# EAGLE design onspeed (EAGLE 8.6.0)
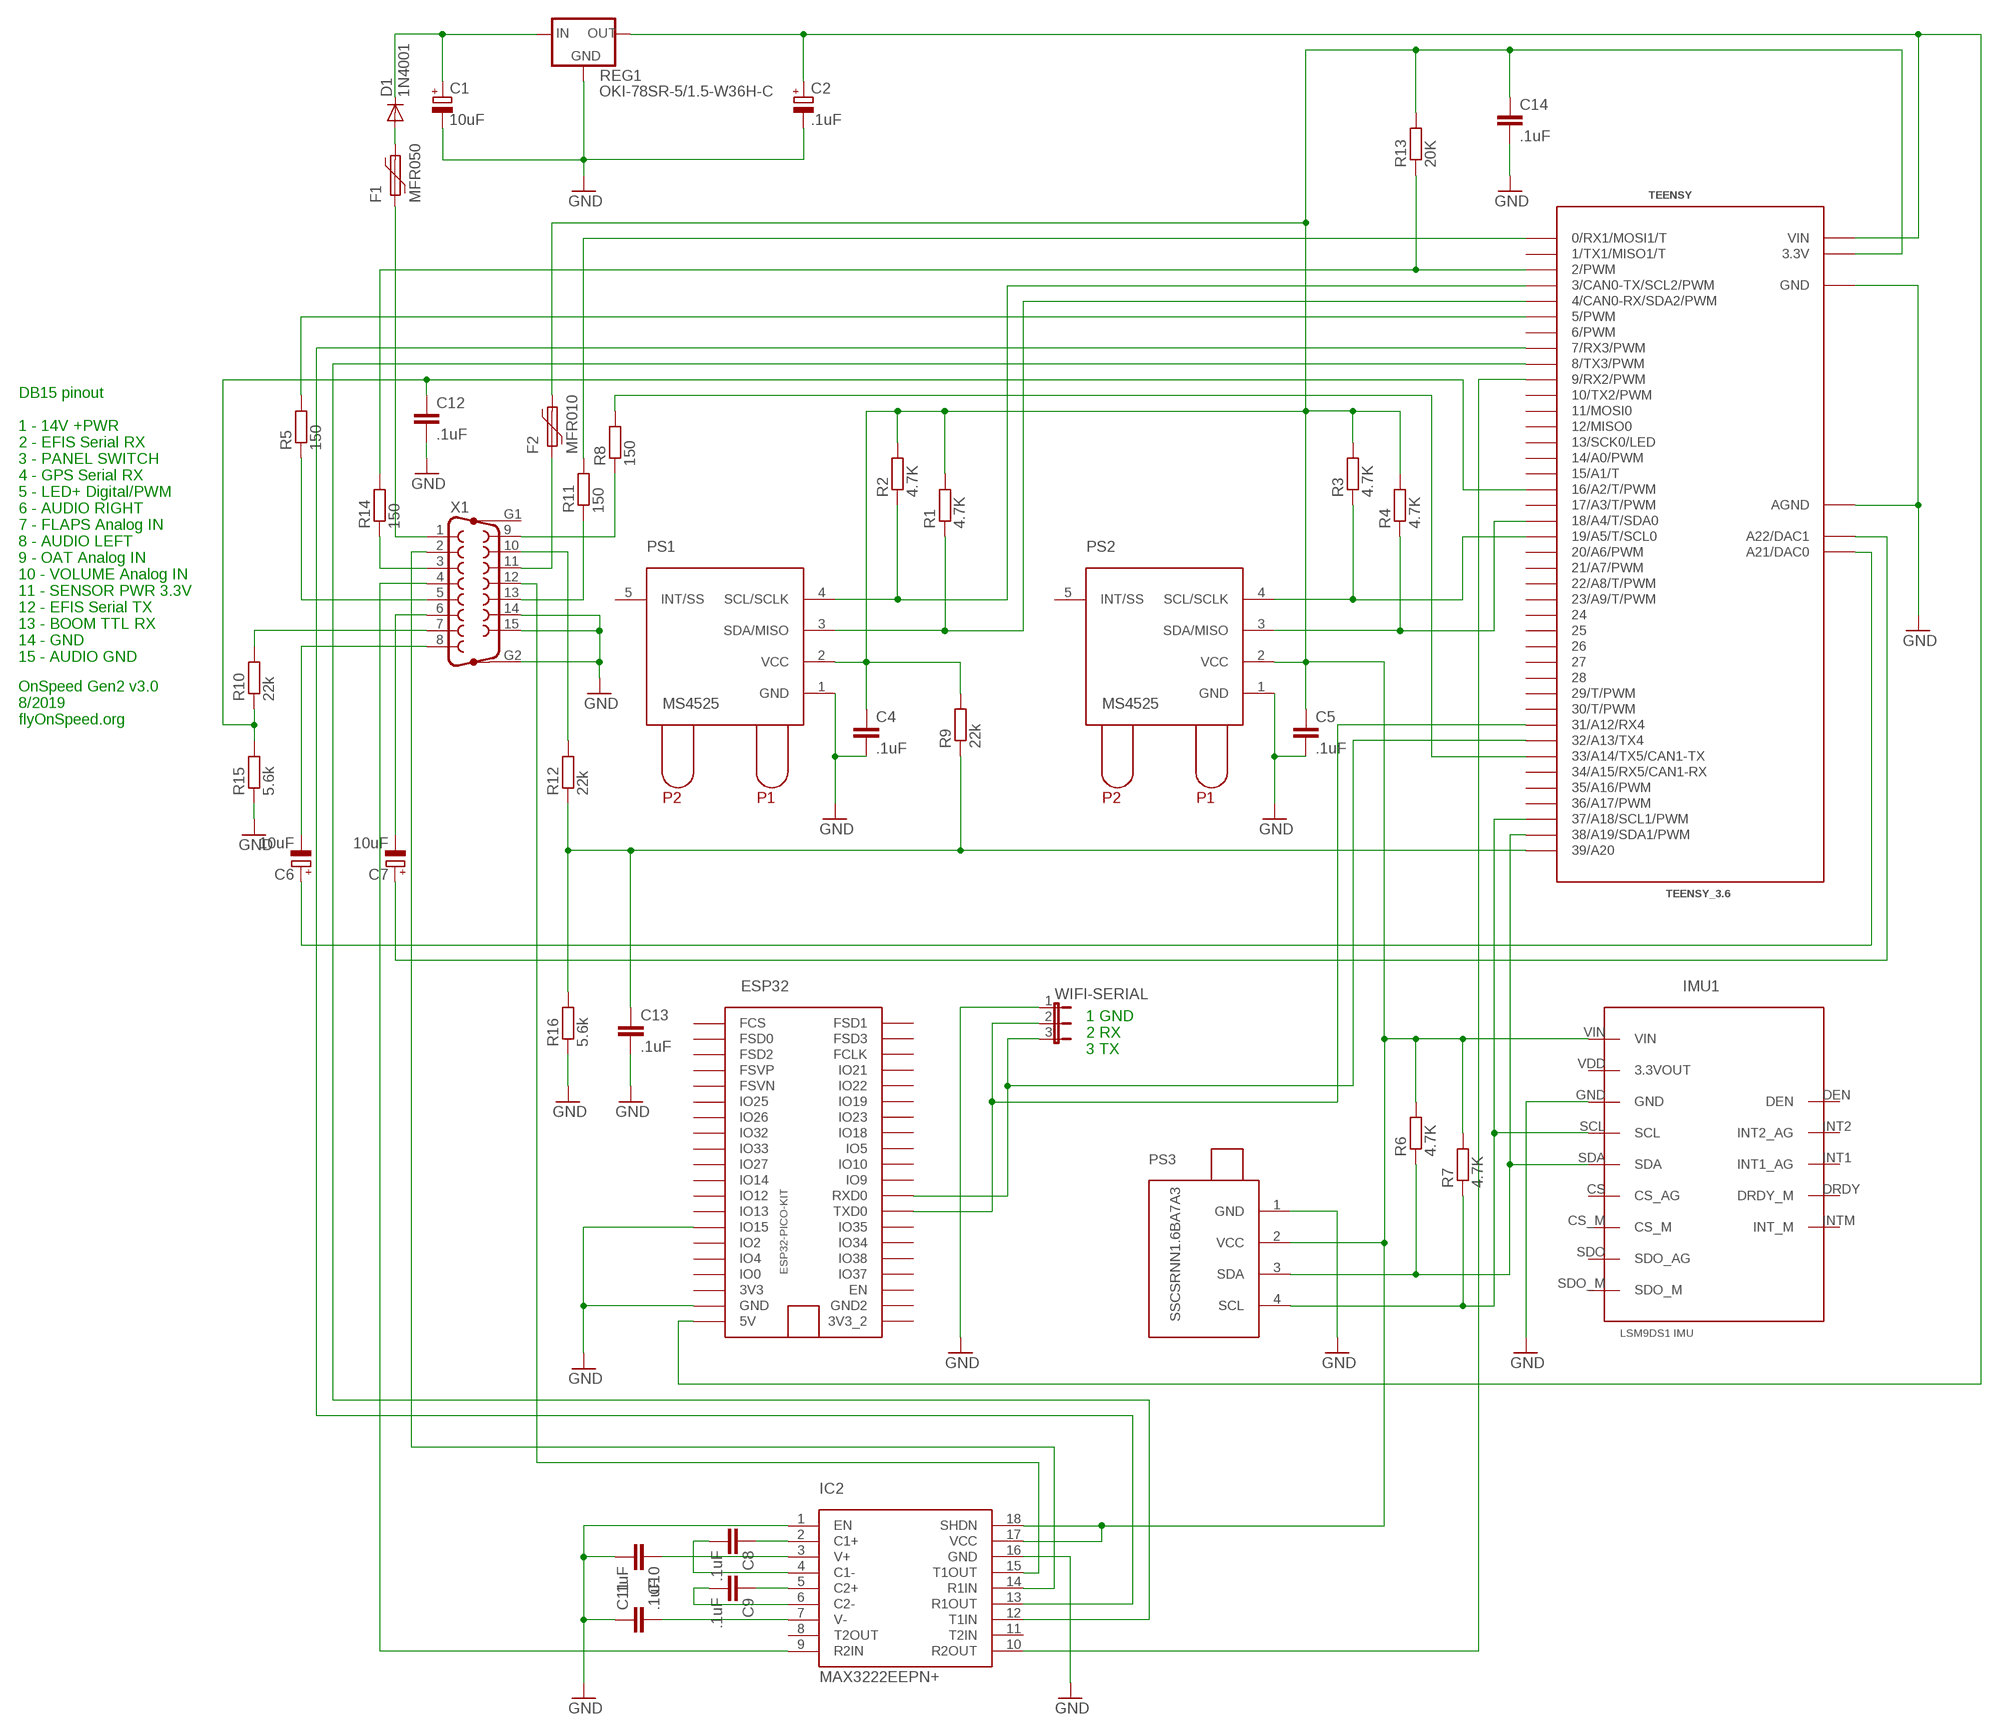
[diagram p0: schematic, sheet 1]

## Parts
C1  10uF  CPOL-EUE2-5  [E2-5]
C2  .1uF  CPOL-EUE2-5  [E2-5]
C4  .1uF  C-EU025-025X050  [C025-025X050]
C5  .1uF  C-EU025-025X050  [C025-025X050]
C6  10uF  CPOL-EUE2-5  [E2-5]
C7  10uF  CPOL-EUE2-5  [E2-5]
C8  .1uF  C-EU025-025X050  [C025-025X050]
C9  .1uF  C-EU025-025X050  [C025-025X050]
C10  .1uF  C-EU025-025X050  [C025-025X050]
C11  .1uF  C-EU025-025X050  [C025-025X050]
C12  .1uF  C-EU025-025X050  [C025-025X050]
C13  .1uF  C-EU025-025X050  [C025-025X050]
C14  .1uF  C-EU025-025X050  [C025-025X050]
D1  1N4001  [DO41-10]
ESP32  ESP32-PICO-KIT  ESP32-PICO-KITPICO  [ESP32PICOKIT]
F1  MFR050  MF-R055-5,1B  [MF-5,1B]
F2  MFR010  MF-R055-5,1B  [MF-5,1B]
IC2  MAX3222EEPN+  [DIL18]
IMU1  LSM9DS1 IMU  LSM9DS1_BREAKOUT  [LSM9DS1_BREAKOUT]
PS1  MS4525  [DIL08-500]
PS2  MS4525  [DIL08-500]
PS3  SSCSRNN1.6BA7A3  [SIP-RN]
R1  4.7K  R-EU_0207/10  [0207/10]
R2  4.7K  R-EU_0207/10  [0207/10]
R3  4.7K  R-EU_0207/10  [0207/10]
R4  4.7K  R-EU_0207/10  [0207/10]
R5  150  R-EU_0207/10  [0207/10]
R6  4.7K  R-EU_0207/10  [0207/10]
R7  4.7K  R-EU_0207/10  [0207/10]
R8  150  R-EU_0207/10  [0207/10]
R9  22k  R-EU_0207/10  [0207/10]
R10  22k  R-EU_0207/10  [0207/10]
R11  150  R-EU_0207/10  [0207/10]
R12  22k  R-EU_0207/10  [0207/10]
R13  20K  R-EU_0207/10  [0207/10]
R14  150  R-EU_0207/10  [0207/10]
R15  5.6k  R-EU_0207/10  [0207/10]
R16  5.6k  R-EU_0207/10  [0207/10]
REG1  OKI-78SR-5/1.5-W36H-C  [SIP3H]
TEENSY  TEENSY_3.6  TEENSY_3.6_DIL  [TEENSY_3.6_DIL]
WIFI-SERIAL  JP2E  [JP2]
X1  F15HP  [F15HP]

## Nets
GND [power]: C1.- C2.- C4.2 C5.2 C10.2 C11.1 C12.2 C13.2 C14.2 ESP32.P$GND(GND) ESP32.P$IO15(IO15) IC2.1(EN) IC2.16(GND) IMU1.GND PS1.1(GND) PS2.1(GND) PS3.1(GND) R15.1 R16.1 REG1.2(GND) TEENSY.AGND TEENSY.GND TEENSY.GND1(GND) WIFI-SERIAL.1 X1.14 X1.15 X1.G2
N$1 [power]: C1.+ D1.C REG1.1(IN)
N$2: IC2.15(T1OUT) X1.12
N$3: R12.2 X1.10
N$4: C2.+ ESP32.P$5V(5V) REG1.3(OUT) TEENSY.VIN
N$5: C12.1 R10.1 R15.2 TEENSY.16/A2(16/A2/T/PWM)
N$6: C7.- X1.6
N$7: R5.2 TEENSY.5(5/PWM)
N$8: IC2.12(T1IN) TEENSY.8(8/TX3/PWM)
N$9: ESP32.P$RXD0(RXD0) TEENSY.32/A13(32/A13/TX4) WIFI-SERIAL.3
N$10: ESP32.P$TXD0(TXD0) TEENSY.31/A12(31/A12/RX4) WIFI-SERIAL.2
N$11: IC2.9(R2IN) X1.4
N$12: R11.2 TEENSY.0(0/RX1/MOSI1/T)
N$13: IC2.14(R1IN) X1.2
N$14: IC2.10(R2OUT) TEENSY.9(9/RX2/PWM)
N$15: C7.+ TEENSY.A22(A22/DAC1)
N$16: PS1.4(SCL/SCLK) R2.1 TEENSY.3(3/CAN0-TX/SCL2/PWM)
N$17: PS1.3(SDA/MISO) R1.1 TEENSY.4(4/CAN0-RX/SDA2/PWM)
N$18: R8.2 TEENSY.33/A14(33/A14/TX5/CAN1-TX)
N$19: PS2.4(SCL/SCLK) R3.1 TEENSY.19/A5(19/A5/T/SCL0)
N$20 [power]: D1.A F1.2
N$21: PS2.3(SDA/MISO) R4.1 TEENSY.18/A4(18/A4/T/SDA0)
N$22: R13.1 R14.2 TEENSY.2(2/PWM)
N$23: C6.- X1.8
N$24: IC2.13(R1OUT) TEENSY.7(7/RX3/PWM)
N$25: R8.1 X1.9
N$26: C6.+ TEENSY.A21(A21/DAC0)
N$27: C8.2 IC2.4(C1-)
N$28: C13.1 R9.1 R12.1 R16.2 TEENSY.39/A20
N$29 [power]: F1.1 X1.1
N$30: C4.1 C5.1 C14.1 F2.2 IC2.17(VCC) IC2.18(SHDN) IMU1.VIN PS1.2(VCC) PS2.2(VCC) PS3.2(VCC) R1.2 R2.2 R3.2 R4.2 R6.2 R7.2 R9.2 R13.2 TEENSY.3.3V TEENSY.3.3V3(3.3V)
N$31: C9.2 IC2.6(C2-)
N$33: F2.1 X1.11
N$34: IMU1.SCL PS3.4(SCL) R7.1 TEENSY.37/A18(37/A18/SCL1/PWM)
N$35: IMU1.SDA PS3.3(SDA) R6.1 TEENSY.38/A19(38/A19/SDA1/PWM)
N$36: C11.2 IC2.7(V-)
N$37: R5.1 X1.5
N$38: C10.1 IC2.3(V+)
N$39: C8.1 IC2.2(C1+)
N$40: C9.1 IC2.5(C2+)
N$41: R11.1 X1.13
N$42: R10.2 X1.7
N$43: R14.1 X1.3
Unconnected: ESP32.P$3V3(3V3) ESP32.P$3V3_2(3V3_2) ESP32.P$EN(EN) ESP32.P$FCLK(FCLK) ESP32.P$FCS(FCS) ESP32.P$FSD0(FSD0) ESP32.P$FSD1(FSD1) ESP32.P$FSD2(FSD2) ESP32.P$FSD3(FSD3) ESP32.P$FSVN(FSVN) ESP32.P$FSVP(FSVP) ESP32.P$GND2(GND2) ESP32.P$IO0(IO0) ESP32.P$IO2(IO2) ESP32.P$IO4(IO4) ESP32.P$IO5(IO5) ESP32.P$IO9(IO9) ESP32.P$IO10(IO10) ESP32.P$IO12(IO12) ESP32.P$IO13(IO13) ESP32.P$IO14(IO14) ESP32.P$IO18(IO18) ESP32.P$IO19(IO19) ESP32.P$IO21(IO21) ESP32.P$IO22(IO22) ESP32.P$IO23(IO23) ESP32.P$IO25(IO25) ESP32.P$IO26(IO26) ESP32.P$IO27(IO27) ESP32.P$IO32(IO32) ESP32.P$IO33(IO33) ESP32.P$IO34(IO34) ESP32.P$IO35(IO35) ESP32.P$IO37(IO37) ESP32.P$IO38(IO38) IC2.8(T2OUT) IC2.11(T2IN) IMU1.CS(CS_AG) IMU1.CS_M IMU1.DEN IMU1.DRDY(DRDY_M) IMU1.INT1(INT1_AG) IMU1.INT2(INT2_AG) IMU1.INTM(INT_M) IMU1.SDO(SDO_AG) IMU1.SDO_M IMU1.VDD(3.3VOUT) PS1.5(INT/SS) PS2.5(INT/SS) TEENSY.1(1/TX1/MISO1/T) TEENSY.6(6/PWM) TEENSY.10(10/TX2/PWM) TEENSY.11(11/MOSI0) TEENSY.12(12/MISO0) TEENSY.13(13/SCK0/LED) TEENSY.14/A0(14/A0/PWM) TEENSY.15/A1(15/A1/T) TEENSY.17/A3(17/A3/T/PWM) TEENSY.20/A6(20/A6/PWM) TEENSY.21/A7(21/A7/PWM) TEENSY.22/A8(22/A8/T/PWM) TEENSY.23/A9(23/A9/T/PWM) TEENSY.24 TEENSY.25 TEENSY.26 TEENSY.27 TEENSY.28 TEENSY.29(29/T/PWM) TEENSY.30(30/T/PWM) TEENSY.34/A15(34/A15/RX5/CAN1-RX) TEENSY.35/A16(35/A16/PWM) TEENSY.36/A17(36/A17/PWM) X1.G1

## Notes on the sheet
- DB15 pinout
  
  1 - 14V +PWR
  2 - EFIS Serial RX
  3 - PANEL SWITCH
  4 - GPS Serial RX
  5 - LED+ Digital/PWM
  6 - AUDIO RIGHT
  7 - FLAPS Analog IN
  8 - AUDIO LEFT
  9 - OAT Analog IN
  10 - VOLUME Analog IN
  11 - SENSOR PWR 3.3V
  12 - EFIS Serial TX
  13 - BOOM TTL RX
  14 - GND
  15 - AUDIO GND
- OnSpeed Gen2 v3.0
  8/2019
  flyOnSpeed.org
- 1 GND
  2 RX
  3 TX

## Library data of the parts
C1 C2 C6 C7 = resistor:CPOL-EU: POLARIZED CAPACITOR, European symbol
C4 C5 C12-C14 = rcl:C-EU: CAPACITOR, European symbol
C8-C11 = rcl:C-EU: CAPACITOR, European symbol; SPICEPREFIX: C
D1 = diode:1N4001: DIODE general purpose rectifier, 1 A
ESP32 = ESP32PicoKit:ESP32-PICO-KIT
F1 F2 = bourns2:MF-R055: MultiFuse Polyfuse Overcurrent Protectors
IC2 = MAX3222E:MAX3222E
IMU1 = adafruit_LSM9DS1:LSM9DS1_BREAKOUT
PS1 PS2 = MS4525:MS4525
PS3 = honeywell_SSC_sensor:SSCSRNN1.6BA7A3
R1-R16 = rcl:R-EU_: RESISTOR, European symbol
REG1 = Murata_OKI-78SR:OKI-78SR-5
TEENSY = Teensy_3_and_LC_Series_Boards_v1.4:TEENSY_3.6_DIL: Teensy 3.6 DIL Package
WIFI-SERIAL = jumper:JP2E: JUMPER
X1 = F15HP-HARTING:F15HP: SUB-D; OC_FARNELL: unknown; OC_NEWARK: unknown

## Net classes
0 default: width 0.508 mm, clearance 0.203 mm
1 power: width 0.635 mm, clearance 0.203 mm to class 0, clearance 0.203 mm

## Board
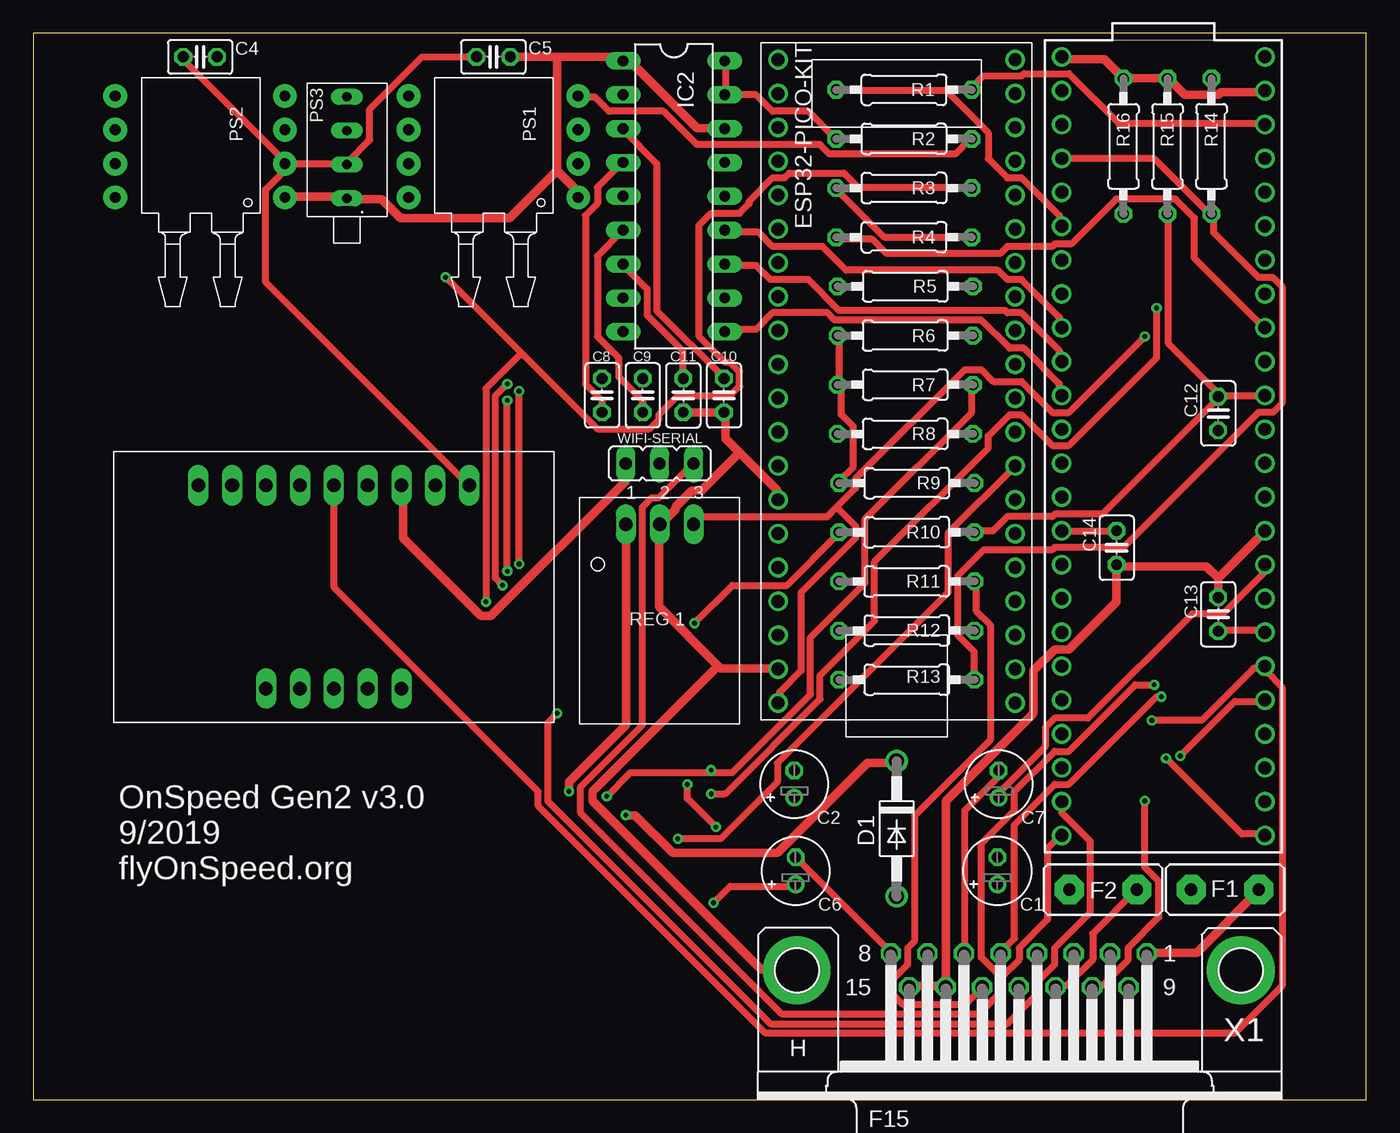
[diagram p1: board, top side]
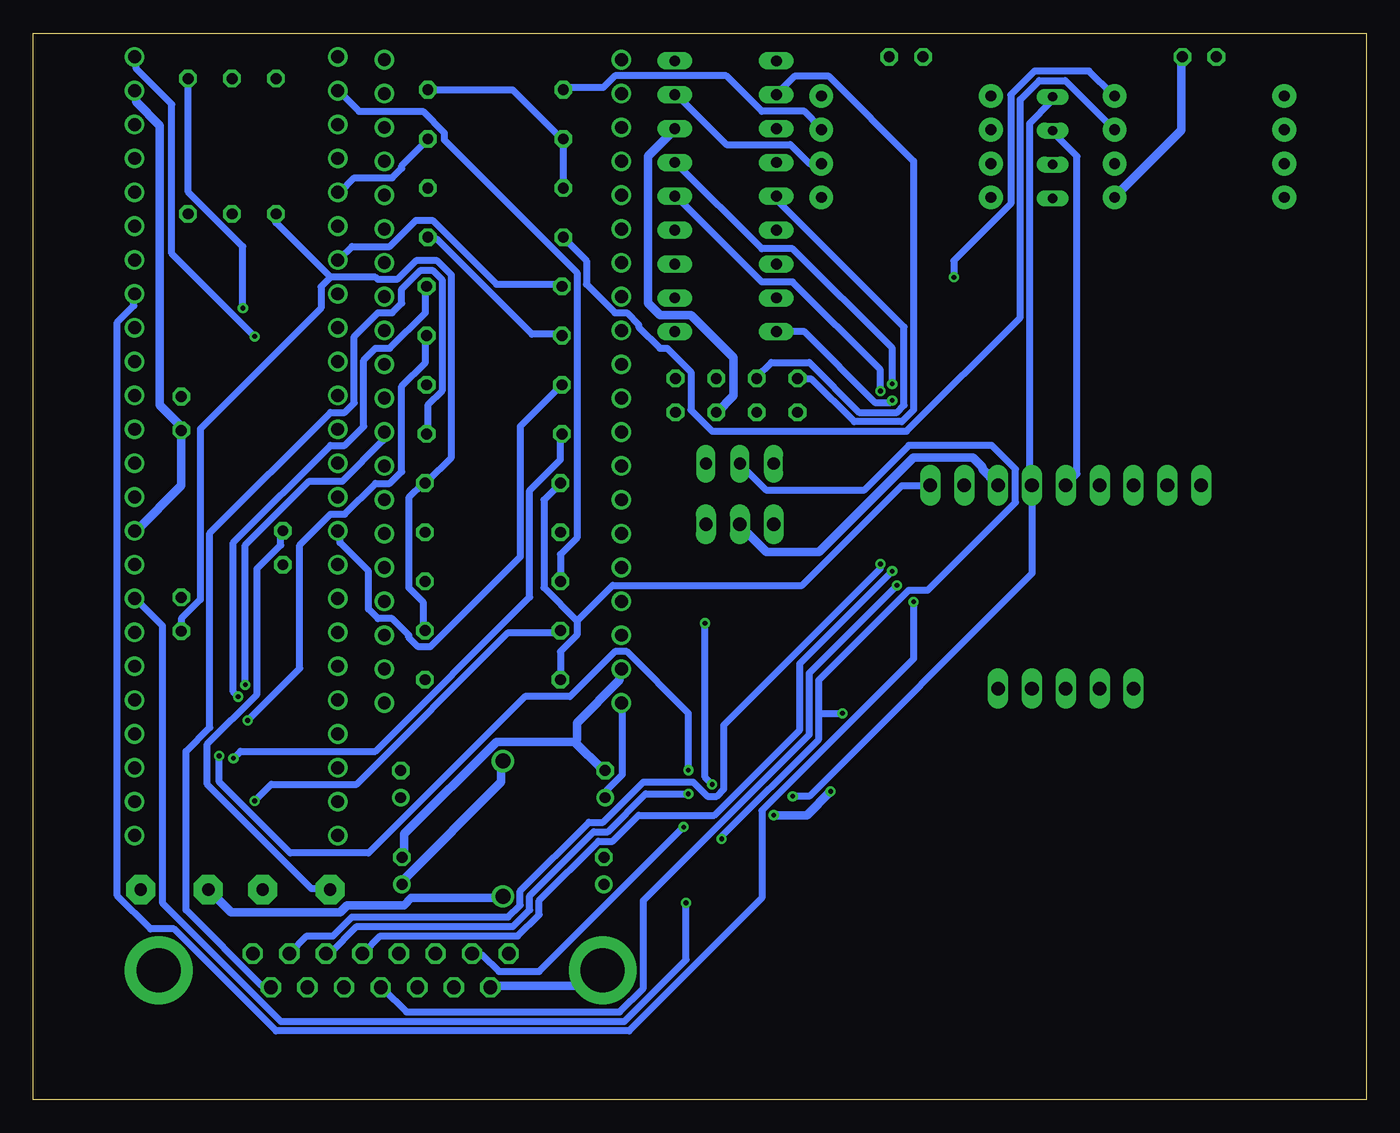
[diagram p2: board, bottom side, seen from below]

Size 100 x 80 mm. Coordinates in mm from the lower left corner, seen from the top.
Outline: 0,0 100,0 100,80 0,80 0,0
Copper layers (1*16): Top 0.035mm / dielectric 1.5mm / Bottom 0.035mm
Design rules "default *": minimum track width 10mil, minimum drill 0.35mm, track to track 6mil, track to pad 6mil, pad to pad 6mil, via to via 6mil, smd to smd 6mil, copper to edge 40mil, drill to drill 6mil, minimum pad ring 10mil, minimum via ring 8mil, stop-mask expansion 2mil, vias tented up to drill 0mil, thermal gap 10mil
tRestrict: area 0,0 to 4.5,80; area 95.5,0 to 100,80
bRestrict: area 0,0 to 4.5,80; area 95.5,0 to 100,80
vRestrict: area 55,0 to 95,6

### Footprints (pad centres in the part's own frame; a part is rotated, then mirrored left to right if it is on the bottom)
E2-5 = drill 0.813 pad 1.27: + -1.016,0 | drill 0.813 pad 1.27 octagon: - 1.016,0
C025-025X050 = drill 0.813 octagon: 1 -1.27,0; 2 1.27,0
DO41-10 = drill 1.118: A 5.08,0; C -5.08,0
ESP32PICOKIT = drill 0.965: P$3V3 -7.62,-10.16; P$3V3_2 10.16,-15.24; P$5V -7.62,-15.24; P$EN 10.16,-10.16; P$FCLK 10.16,27.94; P$FCS -7.62,33.02; P$FSD0 -7.62,30.48; P$FSD1 10.16,33.02; P$FSD2 -7.62,27.94; P$FSD3 10.16,30.48; P$FSVN -7.62,22.86; P$FSVP -7.62,25.4; P$GND -7.62,-12.7; P$GND2 10.16,-12.7; P$IO0 -7.62,-7.62; P$IO2 -7.62,-2.54; P$IO4 -7.62,-5.08; P$IO5 10.16,12.7; P$IO9 10.16,7.62; P$IO10 10.16,10.16; P$IO12 -7.62,5.08; P$IO13 -7.62,2.54; P$IO14 -7.62,7.62; P$IO15 -7.62,0; P$IO18 10.16,15.24; P$IO19 10.16,20.32; P$IO21 10.16,25.4; P$IO22 10.16,22.86; P$IO23 10.16,17.78; P$IO25 -7.62,20.32; P$IO26 -7.62,17.78; P$IO27 -7.62,10.16; P$IO32 -7.62,15.24; P$IO33 -7.62,12.7; P$IO34 10.16,-2.54; P$IO35 10.16,0; P$IO37 10.16,-7.62; P$IO38 10.16,-5.08; P$RXD0 10.16,5.08; P$TXD0 10.16,2.54
MF-5,1B = drill 0.914 pad 2.184 octagon: 1 -2.54,0; 2 2.54,0
DIL18 = drill 0.813 long: 1 -10.16,-3.81; 2 -7.62,-3.81; 3 -5.08,-3.81; 4 -2.54,-3.81; 5 0,-3.81; 6 2.54,-3.81; 7 5.08,-3.81; 8 7.62,-3.81; 9 10.16,-3.81; 10 10.16,3.81; 11 7.62,3.81; 12 5.08,3.81; 13 2.54,3.81; 14 0,3.81; 15 -2.54,3.81; 16 -5.08,3.81; 17 -7.62,3.81; 18 -10.16,3.81
LSM9DS1_BREAKOUT = drill 1.016 long: CS 0,-5.08; CS_M 2.54,-5.08; DEN -7.62,10.16; DRDY 0,10.16; GND -7.62,-5.08; INT1 -2.54,10.16; INT2 -5.08,10.16; INTM 2.54,10.16; SCL -5.08,-5.08; SDA -2.54,-5.08; SDO 5.08,-5.08; SDO_M 7.62,-5.08; VDD -10.16,-5.08; VIN -12.7,-5.08
DIL08-500 = drill 0.813 pad 1.778: 1 -3.81,-6.38; 2 -1.27,-6.38; 3 1.27,-6.38; 4 3.81,-6.38; 5 3.81,6.35; 6 1.27,6.35; 7 -1.27,6.35; 8 -3.81,6.35
SIP-RN = drill 0.7 long: 1 -7.62,0; 2 -5.08,0; 3 -2.54,0; 4 0,0
0207/10 = drill 0.813 octagon: 1 -5.08,0; 2 5.08,0
SIP3H = drill 1 long: 1 2.54,0; 2 0,0; 3 -2.54,0
TEENSY_3.6_DIL = drill 0.965: 0 -7.62,25.4; 1 -7.62,22.86; 2 -7.62,20.32; 3 -7.62,17.78; 3.3V 7.62,22.86; 3.3V3 -7.62,-7.62; 4 -7.62,15.24; 5 -7.62,12.7; 6 -7.62,10.16; 7 -7.62,7.62; 8 -7.62,5.08; 9 -7.62,2.54; 10 -7.62,0; 11 -7.62,-2.54; 12 -7.62,-5.08; 13 7.62,-5.08; 14/A0 7.62,-2.54; 15/A1 7.62,0; 16/A2 7.62,2.54; 17/A3 7.62,5.08; 18/A4 7.62,7.62; 19/A5 7.62,10.16; 20/A6 7.62,12.7; 21/A7 7.62,15.24; 22/A8 7.62,17.78; 23/A9 7.62,20.32; 24 -7.62,-10.16; 25 -7.62,-12.7; 26 -7.62,-15.24; 27 -7.62,-17.78; 28 -7.62,-20.32; 29 -7.62,-22.86; 30 -7.62,-25.4; 31/A12 -7.62,-27.94; 32/A13 -7.62,-30.48; 33/A14 7.62,-30.48; 34/A15 7.62,-27.94; 35/A16 7.62,-25.4; 36/A17 7.62,-22.86; 37/A18 7.62,-20.32; 38/A19 7.62,-17.78; 39/A20 7.62,-15.24; A21 7.62,-12.7; A22 7.62,-10.16; AGND 7.62,25.4; GND -7.62,27.94; GND1 7.62,-7.62; VIN 7.62,27.94
JP2 = drill 0.914 long: 1 -2.54,0; 2 0,0; 3 2.54,0
F15HP = drill 1.016 octagon: 1 -9.601,-1.27; 2 -6.858,-1.27; 3 -4.115,-1.27; 4 -1.372,-1.27; 5 1.372,-1.27; 6 4.115,-1.27; 7 6.858,-1.27; 8 9.601,-1.27; 9 -8.23,1.27; 10 -5.486,1.27; 11 -2.743,1.27; 12 0,1.27; 13 2.743,1.27; 14 5.486,1.27; 15 8.23,1.27 | drill 3.302 pad 5.08: G1 -16.662,0; G2 16.662,0

### Placement (x,y rotation side)
C1  72.34,17.16 90 top
C2  57.1,23.67 90 top
C4  12.52,78.23 0 top
C5  34.52,78.23 0 top
C6  57.19,17.16 90 top
C7  72.43,23.67 90 top
C8  42.67,52.83 270 top
C9  45.72,52.83 270 top
C10  51.82,52.83 270 top
C11  48.77,52.83 90 top
C12  88.9,51.48 270 top
C13  88.9,36.41 90 top
C14  81.28,41.4 270 top
D1  64.77,20.32 270 top
ESP32  63.5,45 0 top
F1  89.41,15.75 180 top
F2  80.26,15.75 180 top
IC2  48.06,67.77 270 top
IMU1  20,41 180 top
PS1  34.5,71.49 90 top
PS2  12.5,71.49 90 top
PS3  23.53,75.24 90 top
R1  65.32,75.77 0 top
R2  65.32,72.08 180 top
R3  65.32,68.39 180 top
R4  65.32,64.7 0 top
R5  65.42,61.01 180 top
R6  65.42,57.32 180 top
R7  65.42,53.63 180 top
R8  65.42,49.94 180 top
R9  65.53,46.25 180 top
R10  65.53,42.56 180 top
R11  65.53,38.87 180 top
R12  65.53,35.19 180 top
R13  65.53,31.5 180 top
R14  88.39,71.52 270 top
R15  85.09,71.52 270 top
R16  81.79,71.52 270 top
REG1  46.99,43.16 180 top
TEENSY  84.78,50.29 0 top
WIFI-SERIAL  46.99,47.71 0 top
X1  73.94,9.69 180 top

### Tracks (layer width: path | path; a pad name or v marks a point on that pad's centre or on a via)
GND
  Top 0.635: TEENSY.GND 77.17,78.05 80.37,78.05 81.61,76.81 R16.1 81.79,76.63 84.99,76.63 R15.1 85.34,76.45 86.41,75.39 88.9,75.39 89.08,75.56 92.28,75.56 TEENSY.AGND | 88.9,39.12 C13.2 | 88.9,39.12 92.28,42.49 TEENSY.GND1 | 88.9,39.12 88.01,40.01 81.43,40.01 C14.2 81.25,39.83 81.25,37.34 77.7,33.78 76.63,33.78 75.03,32.18 75.03,28.98 68.45,22.4 68.45,8.71 X1.14 68.45,8.53 65.79,8.53 X1.15 | PS2.1 19.02,67.74 23.47,67.74 PS3.1 23.82,67.56 26.14,67.56 27.56,66.14 35.74,66.14 39.29,69.7 | 39.29,78.23 43.92,78.23 44.09,78.05 IC2.1 44.45,77.7 44.98,77.7 49.78,72.9 51.74,72.9 IC2.16 | 39.29,78.23 C5.2 | 39.29,69.7 40.72,68.28 40.72,67.74 PS1.1 | 39.29,78.23 39.29,69.7 | WIFI-SERIAL.1 44.45,47.65 44.45,46.41 34.31,36.27 33.6,36.27 27.74,42.14 27.74,46.05 IMU1.GND | C11.1 C10.2 51.92,51.38 51.92,49.61 52.98,48.54 | 52.98,48.54 55.83,45.7 55.83,45.16 ESP32.P$IO15 | 52.98,48.54 50.14,45.7 49.43,45.7 48.18,44.45 48.18,44.27 47.12,43.2 REG1.2 46.94,42.85 46.94,36.98 51.38,32.54 | 51.38,32.54 51.56,32.36 55.83,32.36 ESP32.P$GND | 51.38,32.54 41.96,23.11 41.96,22.4 54.59,9.78 57.25,9.78 X1.G2
  Bottom 0.635: TEENSY.GND1 92.28,42.67 88.9,46.05 C12.2 88.9,50.49 90.5,52.09 90.5,73.08 92.28,74.85 92.28,75.56 TEENSY.AGND | C4.2 13.87,78.23 13.87,72.72 18.85,67.74 PS2.1 | X1.15 65.61,8.53 58.5,8.53 57.43,9.6 X1.G2 | 59.38,26.85 65.25,26.85 72.19,19.91 72.19,18.31 C1.- | 59.38,26.85 57.25,24.71 C2.- | ESP32.P$GND 56.01,32.18 56.01,31.47 59.21,28.27 59.21,27.03 59.38,26.85 | IMU1.GND 27.74,46.23 28.8,47.3 28.8,47.47 29.52,48.18 33.96,48.18 41.07,41.07 44.98,41.07 46.94,43.03 REG1.2 | IC2.16 51.92,72.72 53.87,70.76 53.87,59.74 52.98,58.85 50.67,58.85 47.47,55.65 47.47,52.81 48.72,51.56 C11.1
N$1  (via drill 0.35)
  Top 0.635: v40.18,23.11 40.18,23.82 44.45,28.09 44.45,43.03 REG1.1 | v44.45,21.34 45.16,21.34 48.01,18.49 55.83,18.49 62.59,25.25 64.72,25.25 D1.C
  Bottom 0.635: C1.+ 72.19,16.18 72.19,16.54 64.9,23.82 64.9,25.25 D1.C | v40.18,23.11 41.96,21.34 v44.45,21.34
N$2  (via drill 0.35)
  Top 0.508: v35.56,53.7 34.67,52.81 34.67,39.12 v35.2,38.58
  Bottom 0.508: v35.56,53.7 35.56,56.36 43.03,63.83 45.34,63.83 51.74,70.23 IC2.15 | v35.2,38.58 41.78,32 41.78,27.38 54.23,14.94 54.23,8.36 56.01,6.58 72.01,6.58 73.79,8.36 X1.12
N$3  (via drill 0.35)
  Top 0.508: v83.39,22.4 83.39,17.42 84.45,16.36 84.45,13.69 82.14,11.38 82.14,10.49 80.19,8.53 79.48,8.53 X1.10
  Bottom 0.508: v83.39,22.4 82.14,23.65 75.74,23.65 64.36,35.03 60.45,35.03 R12.2
N$4  (via drill 0.35)
  Top 0.508: v83.39,57.25 77.7,51.56 76.45,51.56 74.14,53.87 72.01,53.87 71.12,54.76 69.88,54.76 61.7,46.58 61.7,45.87 60.27,44.45 | 60.27,44.45 59.56,43.74 50.14,43.74 49.61,43.2 REG1.3 | 60.27,44.45 61.7,43.03 61.7,42.14 57.61,38.05 57.61,32.18 56.01,30.58 56.01,29.87 ESP32.P$5V
  Bottom 0.508: C2.+ 57.07,22.76 57.07,23.11 55.83,24.36 55.83,29.69 ESP32.P$5V | v83.39,57.25 89.61,63.48 89.61,74.68 92.28,77.34 92.28,78.05 TEENSY.VIN
N$5
  Top 0.508: R10.1 70.76,42.67 72.01,42.67 73.08,43.74 76.45,43.74 76.63,43.92 80.19,43.92 88.9,52.63 C12.1 | R15.2 85.17,66.32 85.17,56.72 88.9,52.98 C12.1 | TEENSY.16/A2 92.28,52.81 89.08,52.81 C12.1
N$6
  Top 0.508: C7.- 72.36,24.54 72.36,24.18 69.88,21.69 69.88,11.02 X1.6
N$7
  Bottom 0.508: R5.2 60.45,61.16 65.25,61.16 70.05,65.96 71.3,65.96 73.25,64.01 76.1,64.01 76.99,63.12 TEENSY.5
N$8
  Top 0.508: IC2.12 51.92,62.59 54.23,62.59 55.3,61.52 58.14,61.52 60.45,59.21 72.9,59.21 73.08,59.03 74.14,59.03 76.99,56.19 76.99,55.47 TEENSY.8
N$9  (via drill 0.35)
  Top 0.508: 72.72,9.25 72.72,8.18 70.94,6.4 56.19,6.4 41.07,21.51 41.07,23.47 45.7,28.09 45.7,44.45 46.41,45.16 46.94,45.16 49.43,47.65 WIFI-SERIAL.3 | 72.72,9.25 73.97,10.49 73.97,11.38 76.1,13.51 76.1,18.85 76.99,19.74 TEENSY.32/A13 | v84.1,31.11 82.68,31.11 77.7,26.14 76.63,26.14 73.61,23.11 73.61,21.69 71.12,19.2 71.12,10.67 72.54,9.25 72.72,9.25
  Bottom 0.508: v84.1,31.11 84.1,41.6 79.3,46.41 76.81,46.41 73.79,49.43 73.79,49.96 ESP32.P$RXD0
N$10  (via drill 0.35)
  Top 0.508: v48.36,19.56 51.56,19.56 55.83,23.82 55.83,25.25 68.63,38.05 68.63,42.49 73.61,47.47 ESP32.P$TXD0 | v39.29,28.98 38.58,28.27 38.58,22.4 55.3,5.69 73.08,5.69 75.21,7.82 75.21,8.71 76.63,10.13 76.63,11.38 79.3,14.05 79.3,19.38 77.17,21.51 77.17,22.23 TEENSY.31/A12
  Bottom 0.508: 41.07,28.98 41.07,27.03 48.36,19.74 v48.36,19.56 | 41.07,28.98 41.07,31.47 34.31,38.23 32.89,38.23 26.31,44.81 26.31,47.3 28.09,49.07 34.31,49.07 37.69,45.7 44.98,45.7 46.94,47.65 WIFI-SERIAL.2 | 41.07,28.98 v39.29,28.98
N$11  (via drill 0.35)
  Top 0.508: v35.56,39.65 v35.56,52.45
  Bottom 0.508: v35.56,52.45 35.74,52.27 36.8,52.27 42.14,57.61 44.09,57.61 IC2.9 | v35.56,39.65 42.49,32.72 42.49,27.74 48.9,21.34 54.59,21.34 56.54,19.38 57.61,19.38 62.05,14.94 62.05,13.87 63.65,12.27 73.97,12.27 75.21,11.02 X1.4
N$12
  Bottom 0.508: R11.2 60.45,40.89 59.21,42.14 59.21,62.05 69.16,72.01 69.16,72.54 70.76,74.14 75.56,74.14 76.99,75.56 TEENSY.0
N$13  (via drill 0.35)
  Top 0.508: v36.45,40.18 v36.45,53.16
  Bottom 0.508: v36.45,53.16 36.45,54.76 43.03,61.34 45.34,61.34 51.74,67.74 IC2.14 | v36.45,40.18 36.45,39.83 48.18,28.09 48.18,23.29 48.72,22.76 49.43,22.76 50.49,23.82 54.23,23.82 57.25,20.8 58.32,20.8 63.48,15.65 63.48,14.58 64.36,13.69 76.1,13.69 77.52,12.27 79.48,12.27 80.72,11.02 X1.2
N$14
  Top 0.508: IC2.10 51.92,57.78 54.23,57.78 55.47,59.03 59.56,59.03 60.1,58.5 71.12,58.5 73.25,56.36 74.32,56.36 76.99,53.7 76.99,52.98 TEENSY.9
N$15
  Top 0.508: C7.+ 72.54,22.76 72.54,23.11 75.92,26.49 75.92,27.91 76.63,28.63 79.12,28.63 86.94,36.45 89.26,36.45 92.28,39.47 92.28,40.01 TEENSY.A22
N$16
  Top 0.508: PS1.4 40.89,75.21 42.14,75.21 43.2,74.14 47.3,74.14 49.78,71.65 59.03,71.65 59.74,70.94 69.16,70.94 70.23,72.01 R2.1
  Bottom 0.508: R2.1 70.41,72.01 72.36,70.05 72.36,69.88 73.08,69.16 75.92,69.16 76.99,68.1 TEENSY.3
N$17
  Top 0.508: TEENSY.4 76.99,65.61 76.99,66.32 74.14,69.16 73.08,69.16 71.65,70.59 71.65,72.54 68.45,75.74 60.27,75.74 R1.1
  Bottom 0.508: R1.1 60.1,75.92 57.25,75.92 56.36,76.81 48.01,76.81 45.34,74.14 42.14,74.14 40.89,72.9 PS1.3
N$18  (via drill 0.35)
  Top 0.508: v84.99,25.6 90.68,19.91 92.28,19.91 TEENSY.33/A14
  Bottom 0.508: v84.99,25.6 84.45,26.14 74.32,26.14 62.76,37.69 62.76,45.7 60.45,48.01 60.45,49.78 R8.2
N$19  (via drill 0.35)
  Top 0.508: v30.94,61.7 36.63,56.01 | 36.63,56.01 42.32,50.32 46.23,50.32 46.94,51.03 46.94,51.38 48.36,52.81 52.27,52.81 52.98,53.52 52.98,54.59 52.27,55.3 51.92,55.3 49.96,57.25 49.96,65.61 50.85,66.5 52.98,66.5 53.7,67.21 53.7,67.39 55.47,69.16 56.36,69.16 56.72,69.52 60.81,69.52 61.87,68.45 70.23,68.45 R3.1 | v33.96,37.34 33.96,53.34 36.63,56.01
  Bottom 0.508: v30.94,61.7 30.94,62.94 26.67,67.21 26.67,75.39 24.89,77.17 20.8,77.17 19.02,75.39 PS2.4 | v33.96,37.34 33.96,33.07 45.34,21.69 45.34,15.11 55.3,5.16 81.79,5.16 89.43,12.8 91.21,12.8 93.7,15.29 93.7,58.32 92.46,59.56 92.46,60.27 TEENSY.19/A5
N$20
  Bottom 0.635: D1.A 64.9,15.11 71.65,15.11 72.19,14.58 76.45,14.58 76.99,14.05 85.17,14.05 86.77,15.65 F1.2
N$21
  Top 0.508: R4.1 60.27,64.54 62.94,64.54 64.01,63.48 72.54,63.48 73.08,64.01 76.45,64.01 76.63,64.19 77.88,64.19 81.25,67.56 85.7,67.56 87.12,66.14 87.12,63.12 92.28,57.96 TEENSY.18/A4
  Bottom 0.508: PS2.3 19.02,72.9 22.58,76.45 24.54,76.45 25.96,75.03 25.96,58.67 34.49,50.14 49.07,50.14 50.67,51.74 50.67,54.59 52.45,56.36 52.98,56.36 54.59,57.96 54.59,58.14 55.47,59.03 56.36,59.03 58.5,61.16 58.5,62.94 60.1,64.54 R4.1
N$22
  Top 0.508: R13.1 70.59,31.65 70.59,33.6 69.34,34.85 69.34,39.29 71.3,41.25 76.45,41.25 76.63,41.43 81.79,41.43 91.92,51.56 92.99,51.56 93.7,52.27 93.7,60.98 92.99,61.7 91.92,61.7 88.54,65.08 88.54,66.32 R14.2 88.19,66.5 84.1,70.59 77.17,70.59 TEENSY.2
N$23
  Top 0.508: C6.- 57.25,18.14 64.36,11.02 X1.8
N$24
  Top 0.508: IC2.13 51.92,65.08 54.41,65.08 55.47,64.01 59.21,64.01 60.98,62.23 72.36,62.23 73.08,61.52 74.14,61.52 76.99,58.67 76.99,57.96 TEENSY.7
N$25
  Bottom 0.508: R8.1 70.41,49.96 70.41,52.09 69.34,53.16 69.34,61.52 70.05,62.23 70.94,62.23 72.36,60.81 72.36,59.74 73.08,59.03 74.14,59.03 75.92,57.25 75.92,52.27 76.63,51.56 77.7,51.56 86.77,42.49 86.77,27.91 88.54,26.14 88.54,14.22 82.86,8.53 82.32,8.53 X1.9
N$26  (via drill 0.35)
  Top 0.508: v51.03,14.76 52.27,16 57.07,16 C6.+
  Bottom 0.508: v51.03,14.76 51.03,10.49 55.65,5.87 81.43,5.87 90.32,14.76 90.32,35.56 92.28,37.52 TEENSY.A21
N$27
  Top 0.508: C8.2 42.67,52.45 41.43,53.7 41.43,66.32 42.32,67.21 42.32,68.45 44.09,70.23 IC2.4
N$28
  Top 0.508: C13.1 88.9,35.2 92.28,35.2 TEENSY.39/A20
  Bottom 0.508: R12.1 70.76,35.2 70.76,37.34 71.83,38.41 71.83,45.16 70.76,46.23 R9.1 70.41,46.41 68.63,48.18 68.63,61.87 69.7,62.94 71.3,62.94 72.72,61.52 74.14,61.52 74.32,61.7 77.7,61.7 | R16.2 81.79,65.79 77.7,61.7 | C13.1 88.9,36.09 87.48,37.52 87.48,50.32 78.41,59.38 78.41,60.98 77.7,61.7
N$29
  Top 0.635: X1.1 83.57,11.02 87.3,11.02 91.92,15.65 F1.1
N$30
  Top 0.508: IC2.18 51.92,77.88 51.92,75.56 IC2.17 52.09,75.39 54.23,75.39 55.47,74.14 58.14,74.14 60.1,72.19 R2.2 | R4.2 70.23,64.72 63.83,64.72 60.27,68.28 R3.2 | TEENSY.3.3V 92.28,73.25 81.43,73.25 77.7,76.99 74.32,76.99 74.14,76.81 71.3,76.81 70.41,75.92 R1.2 | C14.1 81.25,42.67 TEENSY.3.3V3 | PS2.2 19.02,70.23 23.47,70.23 PS3.2 23.65,70.41 25.25,72.01 25.25,74.32 29.16,78.23 C5.1 | C4.1 11.38,78.23 11.38,77.88 18.85,70.41 PS2.2 | R6.2 60.45,57.25 60.45,53.7 R7.2 60.63,53.52 60.63,51.38 61.52,50.49 61.52,47.47 60.45,46.41 R9.2 | PS2.2 18.85,70.05 18.85,69.7 17.42,68.28 17.42,61.34 32.54,46.23 IMU1.VIN
  Bottom 0.508: R3.2 60.27,68.45 60.27,72.01 R2.2 60.45,72.19 64.01,75.74 70.23,75.74 R1.2 | PS1.2 40.89,70.23 41.78,70.23 43.2,71.65 48.01,71.65 51.74,75.39 IC2.17 | C14.1 81.43,42.49 81.43,41.6 83.21,39.83 83.21,30.4 86.94,26.67 86.94,23.65 79.12,15.82 77.88,15.82 F2.2 | R13.2 60.45,33.6 59.21,34.85 59.21,35.92 | 59.21,35.92 61.7,38.41 61.7,44.98 60.45,46.23 R9.2 | 59.21,35.92 56.54,38.58 42.32,38.58 34.85,46.05 32.72,46.05 IMU1.VIN | TEENSY.3.3V3 76.99,42.49 76.99,41.78 74.85,39.65 74.85,36.8 74.14,36.09 73.08,36.09 71.83,34.85 71.83,34.67 71.12,33.96 70.23,33.96 63.48,40.72 63.48,50.49 60.45,53.52 R7.2 | R4.2 70.23,64.54 69.7,64.54 62.59,57.43 60.45,57.43 R6.2
N$31
  Top 0.508: C9.2 45.7,51.56 45.7,52.45 43.92,54.23 43.92,55.65 42.32,57.25 42.32,63.3 44.09,65.08 IC2.6
N$33
  Top 0.508: X1.11 76.81,8.53 77.52,8.53 79.48,10.49 79.48,12.45 82.68,15.65 F2.1
N$34  (via drill 0.35)
  Top 0.508: 50.85,24.54 44.81,24.54 v43.03,22.76 | 50.85,24.54 52.45,24.54 58.32,30.4 58.32,34.67 62.41,38.76 62.41,43.56 70.41,51.56 70.41,53.52 R7.1 | v86.06,25.78 90.14,29.87 92.28,29.87 TEENSY.37/A18 | v50.85,24.71 50.85,24.54
  Bottom 0.508: PS3.4 23.65,75.21 23.65,74.85 25.25,73.25 25.25,46.23 IMU1.SCL 25.07,45.87 25.07,39.47 41.78,22.76 v43.03,22.76 | v86.06,25.78 86.06,23.82 80.72,18.49 74.85,18.49 63.12,30.23 59.74,30.23 56.36,33.6 55.47,33.6 50.85,28.98 v50.85,24.71
N$35  (via drill 0.35)
  Top 0.508: v83.92,28.45 87.66,28.45 91.57,32.36 92.28,32.36 TEENSY.38/A19 92.46,32.18 93.7,30.94 93.7,8.53 90.14,4.98 54.94,4.98 37.87,22.05 37.87,23.11 22.58,38.41 22.58,46.05 IMU1.SDA
  Bottom 0.508: PS3.3 23.47,72.54 21.69,70.76 21.69,46.94 22.4,46.23 IMU1.SDA | v83.92,28.45 80.01,32.36 80.01,41.6 77.7,43.92 76.63,43.92 74.32,46.23 73.25,46.23 72.36,47.12 72.36,53.52 70.59,55.3 70.59,57.25 R6.1
N$36
  Top 0.508: C11.2 48.72,54.23 48.72,56.19 46.05,58.85 46.05,60.81 44.27,62.59 IC2.7
N$37  (via drill 0.35)
  Top 0.508: v84.63,30.23 84.28,30.23 77.7,23.65 76.63,23.65 73.61,20.62 73.61,12.09 72.54,11.02 X1.5
  Bottom 0.508: v84.63,30.23 84.99,30.58 84.99,41.78 77.7,49.07 76.63,49.07 75.21,50.49 75.21,55.47 74.32,56.36 73.25,56.36 70.59,59.03 70.59,60.98 R5.1
N$38
  Top 0.508: C10.1 51.74,54.23 46.76,59.21 46.76,70.23 44.27,72.72 IC2.3
N$39
  Bottom 0.508: C8.1 42.67,54.05 41.6,54.05 38.41,50.85 34.85,50.85 33.96,51.74 33.96,70.41 40.36,76.81 42.85,76.81 44.09,75.56 IC2.2
N$40
  Bottom 0.508: IC2.5 44.09,67.74 44.09,67.39 34.67,57.96 34.67,52.09 35.2,51.56 38.05,51.56 41.78,55.3 44.63,55.3 45.7,54.23 C9.1
N$41
  Top 0.508: R11.1 70.76,38.76 70.76,36.63 71.83,35.56 71.83,27.03 66.14,21.34 66.14,11.91 65.61,11.38 65.61,10.13 64.36,8.89 64.36,8 65.25,7.11 69.88,7.11 71.12,8.36 X1.13
N$42  (via drill 0.35)
  Top 0.508: v49.61,35.74 52.45,38.58 56.54,38.58 60.45,42.49 R10.2 | v49.07,23.65 49.07,22.58 v51.21,20.45
  Bottom 0.508: v49.61,35.74 49.61,24.18 v49.07,23.65 | v51.21,20.45 62.05,9.6 65.08,9.6 66.32,10.85 67.03,10.85 X1.7
N$43  (via drill 0.35)
  Top 0.508: v84.28,59.38 84.28,55.65 77.7,49.07 76.45,49.07 74.14,51.38 73.25,51.38 71.65,49.78 71.65,48.9 63.12,40.36 63.12,35.92 59.03,31.83 59.03,30.05 51.92,22.94 v50.85,22.94
  Bottom 0.508: v84.28,59.38 84.28,64.01 88.37,68.1 88.37,76.45 R14.1 | v50.85,22.94 54.05,22.94 56.9,20.09 57.96,20.09 62.76,15.29 62.76,14.22 64.01,12.98 75.74,12.98 77.7,11.02 78.05,11.02 X1.3

### Text on the board
tNames: REG 1 | OnSpeed Gen2 v3.0 / 9/2019 / flyOnSpeed.org